# Altium project ADC1X2200-10_V1-1.PrjPCB (part 2 of 2)

## Sheet ADC-POWER SUPPLY 2.SchDoc: <SPECIFIC SHEET FUNCTION>
size A3; Date: DO NOT USE, RATHER USE PROJ OPTIONS; DrawnBy: DO NOT USE, RATHER USE PROJ OPTIONS; Engineer: DO NOT USE, RATHER USE PROJ OPTIONS; Organization: DO NOT USE, RATHER USE PROJ OPTIONS; DocumentNumber: 12; Revision: DO NOT USE, RATHER USE PROJ OPTIONS; SheetNumber: 12; SheetTotal: 12; SCH_Sheet_Filename: ADC-POWER SUPPLY 2.SchDoc; CurrentTime: DO NOT USE, RATHER USE PROJ OPTIONS; Time: DO NOT USE, RATHER USE PROJ OPTIONS; DocumentFullPathAndName: DO NOT USE, RATHER USE PROJ OPTIONS; DocumentName: DO NOT USE, RATHER USE PROJ OPTIONS; ModifiedDate: DO NOT USE, RATHER USE PROJ OPTIONS; ImagePath: DO NOT USE, RATHER USE PROJ OPTIONS
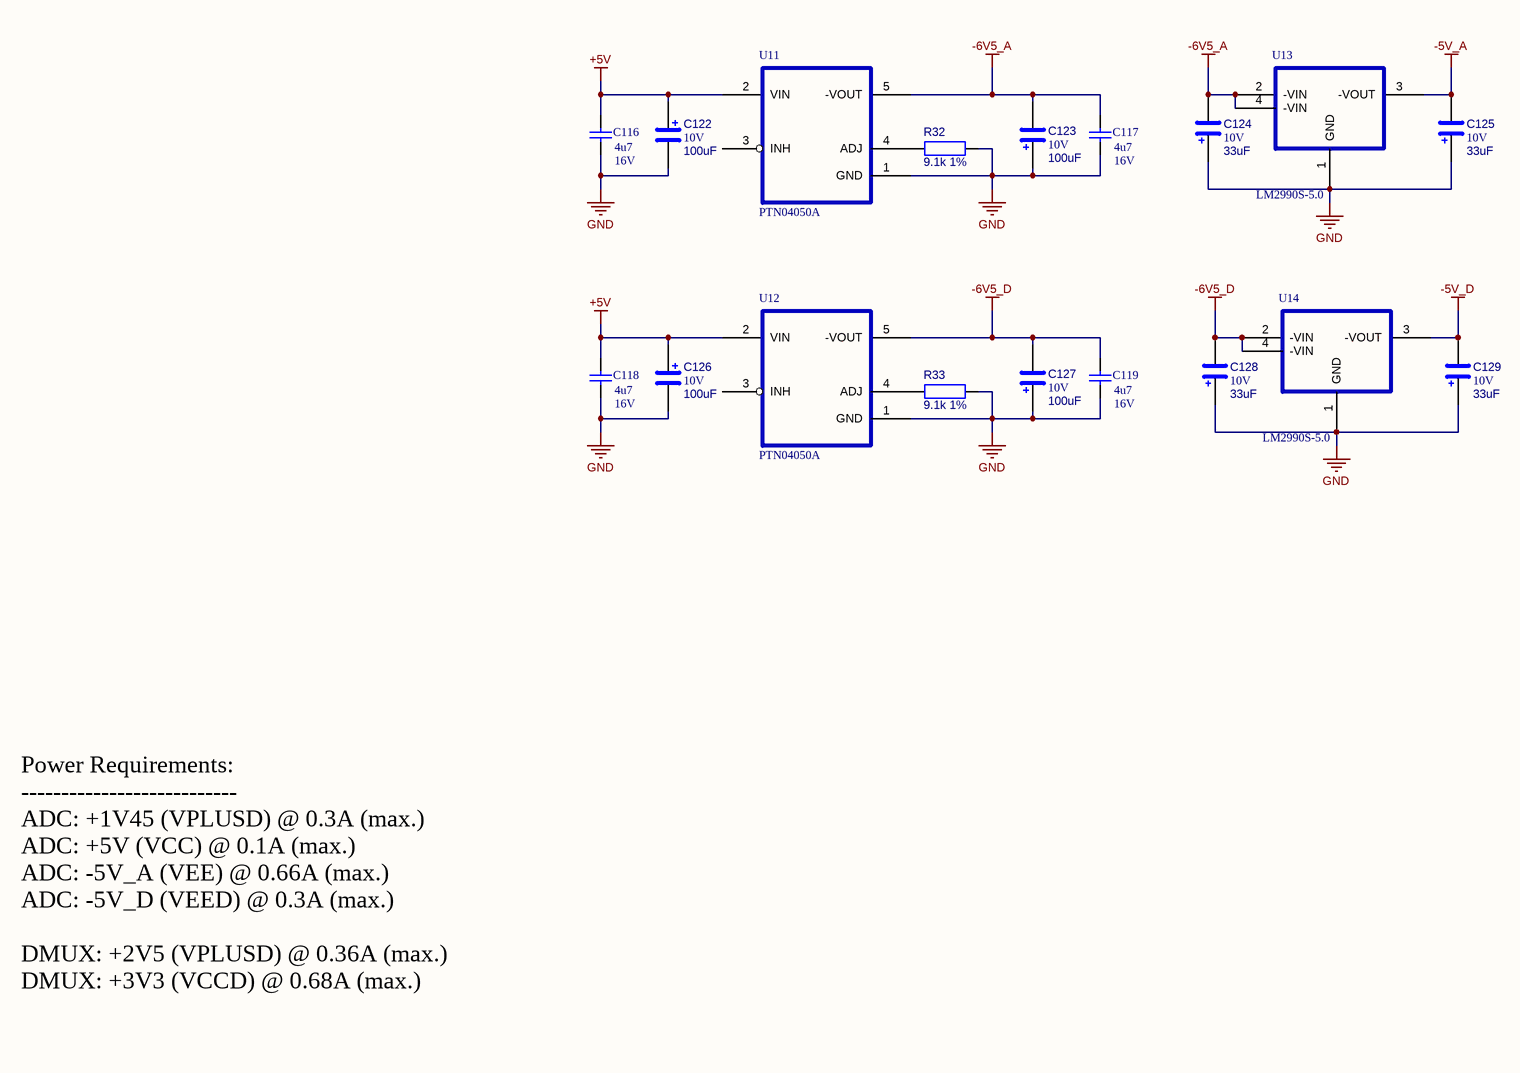
[diagram p7: ADC-POWER SUPPLY 2.SchDoc]

### Parts
C116  value 4u7  Voltage: 16V  [CAPC3225X220N]  (hidden comment: Capacitor 1210 SMD)
C117  value 4u7  Voltage: 16V  [CAPC3225X220N]  (hidden comment: Capacitor 1210 SMD)
C118  value 4u7  Voltage: 16V  [CAPC3225X220N]  (hidden comment: Capacitor 1210 SMD)
C119  value 4u7  Voltage: 16V  [CAPC3225X220N]  (hidden comment: Capacitor 1210 SMD)
C122  Voltage: 10V  [3528]  (hidden comment: 100uF)
C123  Voltage: 10V  [3528]  (hidden comment: 100uF)
C124  Voltage: 10V  [3528]  (hidden comment: 33uF)
C125  Voltage: 10V  [3528]  (hidden comment: 33uF)
C126  Voltage: 10V  [3528]  (hidden comment: 100uF)
C127  Voltage: 10V  [3528]  (hidden comment: 100uF)
C128  Voltage: 10V  [3528]  (hidden comment: 33uF)
C129  Voltage: 10V  [3528]  (hidden comment: 33uF)
R32  9.1k 1%  [0603]
R33  9.1k 1%  [0603]
U11  PTN04050A  [TI_EUU]
U12  PTN04050A  [TI_EUU]
U13  LM2990S-5.0  [TI_TO-263-3]
U14  LM2990S-5.0  [TI_TO-263-3]

### Nets
+5V: C116.2 C118.2 C122.1 C126.1 U11.2(VIN) U12.2(VIN)
-5V_A: C125.2 U13.3(-VOUT)
-5V_D: C129.2 U14.3(-VOUT)
-6V5_A: C117.2 C123.2 C124.2 U11.5(-VOUT) U13.2(-VIN) U13.4(-VIN)
-6V5_D: C119.2 C127.2 C128.2 U12.5(-VOUT) U14.2(-VIN) U14.4(-VIN)
GND: C116.1 C117.1 C118.1 C119.1 C122.2 C123.1 C124.1 C125.1 C126.2 C127.1 C128.1 C129.1 R32.2 R33.2 U11.1(GND) U12.1(GND) U13.1(GND) U14.1(GND)
NetR32_1: R32.1 U11.4(ADJ)
NetR33_1: R33.1 U12.4(ADJ)

Not connected (* = marked no-connect by the designer): U11 3(INH); U12 3(INH)

### Notes on the sheet
- Power Requirements:
  ---------------------------
  ADC: +1V45 (VPLUSD) @ 0.3A (max.)
  ADC: +5V (VCC) @ 0.1A (max.)
  ADC: -5V_A (VEE) @ 0.66A (max.)
  ADC: -5V_D (VEED) @ 0.3A (max.)
  DMUX: +2V5 (VPLUSD) @ 0.36A (max.)
  DMUX: +3V3 (VCCD) @ 0.68A (max.)
- 2009   THIS DOCUMENT IS THE PROPERTY OF THE OWNER, AND MAY NOT BE COPIED OR USED FOR ANY PURPOSE OTHER THAN THAT FOR WHICH IT IS SUPPLIED WITHOUT PERMISSION IN WRITING FROM THE OWNER.
- C
- DATESTAMP OF THIS PRINT
- DRAWN BY:
- DOCUMENT NUMBER:
- SCHEMATIC FILENAME:
- PCB FILENAME:
- ENGINEER:
- APPROVED:
- CIRCUIT DIAGRAM
- DATE
- SHEET
- REVISION
- OF

### Library data of the parts
C116-C119 = cap1210: Created_By: EDA-ASA; Checked_By: *; Checked_Date: *; HelpURL: *; Supplier1: *; Supplier2: *; Unit_Cost: *; MOQ: *; Leadtime: *; Inventory_Stock: *; Tolerance: *; Wattage: *; Package: 1210; ComponentLinked1Description: *; ComponentLinked1URL: *; ComponentLinked2Description: *; ComponentLinked2URL: *; ComponentLinked3Description: *; ComponentLinked3URL: *; ComponentLinked4Description: *; ComponentLinked4URL: *
C122-C129 = CAPACITOR-POLARISED: Created_By: EDA-ASA; Checked_By: *; Checked_Date: *; HelpURL: *; ComponentLinked1Description: *; ComponentLinked1URL: *; ComponentLinked2Description: *; ComponentLinked2URL: *; ComponentLinked3Description: *; ComponentLinked3URL: *; ComponentLinked4Description: *; ComponentLinked4URL: *; Supplier1: *; Supplier2: *; Unit_Cost: *; MOQ: *; Leadtime: *; Inventory_Stock: *; Tolerance: *; Wattage: *
  C122 C123 C126 C127: Value: 100uF
  C124 C125 C128 C129: Value: 33uF
R32 R33 = RES-0805: RESISTOR SMD 0603; Checked_By: NN; Manufacturer: *; Manufacturer_PN: *; Created_By: *; Checked_Date: 5-08-2009; HelpURL: *; ComponentLink1Description: Footprint Detail; ComponentLink1URL: *; ComponentLink2Description: Application Note; ComponentLink2URL: *; ComponentLink3Description: Layout Guidelines; ComponentLink3URL: *; ComponentLink4Description: Technology Reference; ComponentLink4URL: *; Supplier1: *; Supplier2: *; Unit_Cost: *; MOQ: *; Leadtime: *; Inventory_Stock: *; Tolerance: *; Wattage: *; Voltage: *; Package: 0603; ComponentLink5Description: Production Detail; ComponentLink5URL: *; Note: *; Stock Code: *; Value: 9.1k 1%

## Sheet ADC-SYNC INPUT.SchDoc: <SPECIFIC SHEET FUNCTION>
size A3; Date: DO NOT USE, RATHER USE PROJ OPTIONS; DrawnBy: DO NOT USE, RATHER USE PROJ OPTIONS; Engineer: DO NOT USE, RATHER USE PROJ OPTIONS; Organization: DO NOT USE, RATHER USE PROJ OPTIONS; DocumentNumber: 9; Revision: DO NOT USE, RATHER USE PROJ OPTIONS; SheetNumber: 7; SheetTotal: 12; SCH_Sheet_Filename: ADC-SYNC INPUT.SchDoc; CurrentTime: DO NOT USE, RATHER USE PROJ OPTIONS; Time: DO NOT USE, RATHER USE PROJ OPTIONS; DocumentFullPathAndName: DO NOT USE, RATHER USE PROJ OPTIONS; DocumentName: DO NOT USE, RATHER USE PROJ OPTIONS; ModifiedDate: DO NOT USE, RATHER USE PROJ OPTIONS; ImagePath: DO NOT USE, RATHER USE PROJ OPTIONS
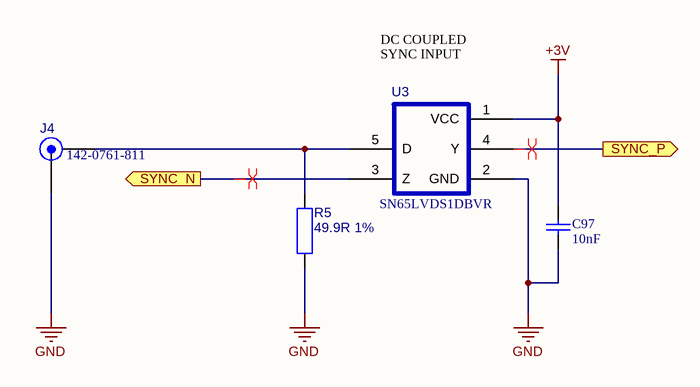
[diagram p8: ADC-SYNC INPUT.SchDoc]

### Parts
C97  value 10nF  [CAPC1005X55N]  (hidden comment: Capacitor 0402 SMD)
J4  142-0761-811  [EDGE_LAUNCH_TH_SMA]
R5  49.9R 1%  [0603]
U3  SN65LVDS1DBVR  [SOT95P280X145-5N]

### Ports
SYNC_N (out), SYNC_P (out)

### Nets
+3V: C97.2 U3.1(VCC)
GND: C97.1 J4.2 R5.2 U3.2(GND)
SYNC_N: U3.3(Z) ; port SYNC_N
SYNC_P: U3.4(Y) ; port SYNC_P
NetJ4_1: J4.1 R5.1 U3.5(D)

### Layout directives
differential pair: SYNC_N, SYNC_P

### Notes on the sheet
- DC COUPLED SYNC INPUT
- 2009   THIS DOCUMENT IS THE PROPERTY OF THE OWNER, AND MAY NOT BE COPIED OR USED FOR ANY PURPOSE OTHER THAN THAT FOR WHICH IT IS SUPPLIED WITHOUT PERMISSION IN WRITING FROM THE OWNER.
- C
- DATESTAMP OF THIS PRINT
- DRAWN BY:
- DOCUMENT NUMBER:
- SCHEMATIC FILENAME:
- PCB FILENAME:
- ENGINEER:
- APPROVED:
- CIRCUIT DIAGRAM
- DATE
- SHEET
- REVISION
- OF

### Library data of the parts
C97 = cap0402: Created_By: EDA-ASA; Checked_By: *; Checked_Date: *; HelpURL: *; Supplier1: *; Supplier2: *; Unit_Cost: *; MOQ: *; Leadtime: *; Inventory_Stock: *; Tolerance: *; Wattage: *; Package: 0402; ComponentLinked1Description: *; ComponentLinked1URL: *; ComponentLinked2Description: *; ComponentLinked2URL: *; ComponentLinked3Description: *; ComponentLinked3URL: *; ComponentLinked4Description: *; ComponentLinked4URL: *
J4 = 142-0761-811: High Frequency SMA End Lauch Connector; Manufacturer: JOHNSON; Created_By: CT; Checked_By: *; Checked_Date: *; HelpURL: *; ComponentLink1Description: High Frequency SMA End Lauch Connector; ComponentLink1URL: *; ComponentLink2Description: Application Note; ComponentLink2URL: *; ComponentLink3Description: Layout Guidelines; ComponentLink3URL: *; ComponentLink4Description: Technology Reference; ComponentLink4URL: *; Supplier1: *; Supplier2: *; Unit_Cost: *; MOQ: *; Leadtime: *; Inventory_Stock: *; Tolerance: *; Wattage: *; Package: *; ComponentLink5Description: Production Detail; ComponentLink5URL: *; Note: *; Stock Code: *; Voltage: *; Manufacturer_PN: 142-0761-811
R5 = RES-0805: RESISTOR SMD 0603; Checked_By: NN; Manufacturer: *; Manufacturer_PN: *; Created_By: *; Checked_Date: 5-08-2009; HelpURL: *; ComponentLink1Description: Footprint Detail; ComponentLink1URL: *; ComponentLink2Description: Application Note; ComponentLink2URL: *; ComponentLink3Description: Layout Guidelines; ComponentLink3URL: *; ComponentLink4Description: Technology Reference; ComponentLink4URL: *; Supplier1: *; Supplier2: *; Unit_Cost: *; MOQ: *; Leadtime: *; Inventory_Stock: *; Tolerance: *; Wattage: *; Voltage: *; Package: 0603; ComponentLink5Description: Production Detail; ComponentLink5URL: *; Note: *; Stock Code: *; Value: 49.9R 1%
U3 = SN65LVDS1DBVR: High Speed Differential Line Driver/Receiver; Manufacturer: TI; Created_By: IN; Manufacturer_PN: SN65LVDS1DBVR; Checked_By: *; Checked_Date: *; HelpURL: X:\Datasheets\By_Manufacturer\TI\sn65lvds1.pdf; ComponentLink1Description: X:\Datasheets\By_Manufacturer\TI\sn65lvds1.pdf#page=13; ComponentLink1URL: *; ComponentLink2Description: Application Note; ComponentLink2URL: *; ComponentLink3Description: Layout Guidelines; ComponentLink3URL: *; ComponentLink4Description: Technology Reference; ComponentLink4URL: *; Supplier1: *; Supplier2: *; Unit_Cost: *; MOQ: *; Leadtime: *; Inventory_Stock: *; Tolerance: *; Wattage: *; Voltage: *; Package: *; ComponentLink5Description: Production Detail; ComponentLink5URL: *; Note: *; Stock Code: *

## Sheet ADC-DMUX PSU.SchDoc: <SPECIFIC SHEET FUNCTION>
size A3; Date: DO NOT USE, RATHER USE PROJ OPTIONS; DrawnBy: DO NOT USE, RATHER USE PROJ OPTIONS; Engineer: DO NOT USE, RATHER USE PROJ OPTIONS; Organization: DO NOT USE, RATHER USE PROJ OPTIONS; DocumentNumber: 1; Revision: DO NOT USE, RATHER USE PROJ OPTIONS; SheetNumber: 10; SheetTotal: 12; SCH_Sheet_Filename: ADC-DMUX PSU.SchDoc; CurrentTime: DO NOT USE, RATHER USE PROJ OPTIONS; Time: DO NOT USE, RATHER USE PROJ OPTIONS; DocumentFullPathAndName: DO NOT USE, RATHER USE PROJ OPTIONS; DocumentName: DO NOT USE, RATHER USE PROJ OPTIONS; ModifiedDate: DO NOT USE, RATHER USE PROJ OPTIONS; ImagePath: DO NOT USE, RATHER USE PROJ OPTIONS
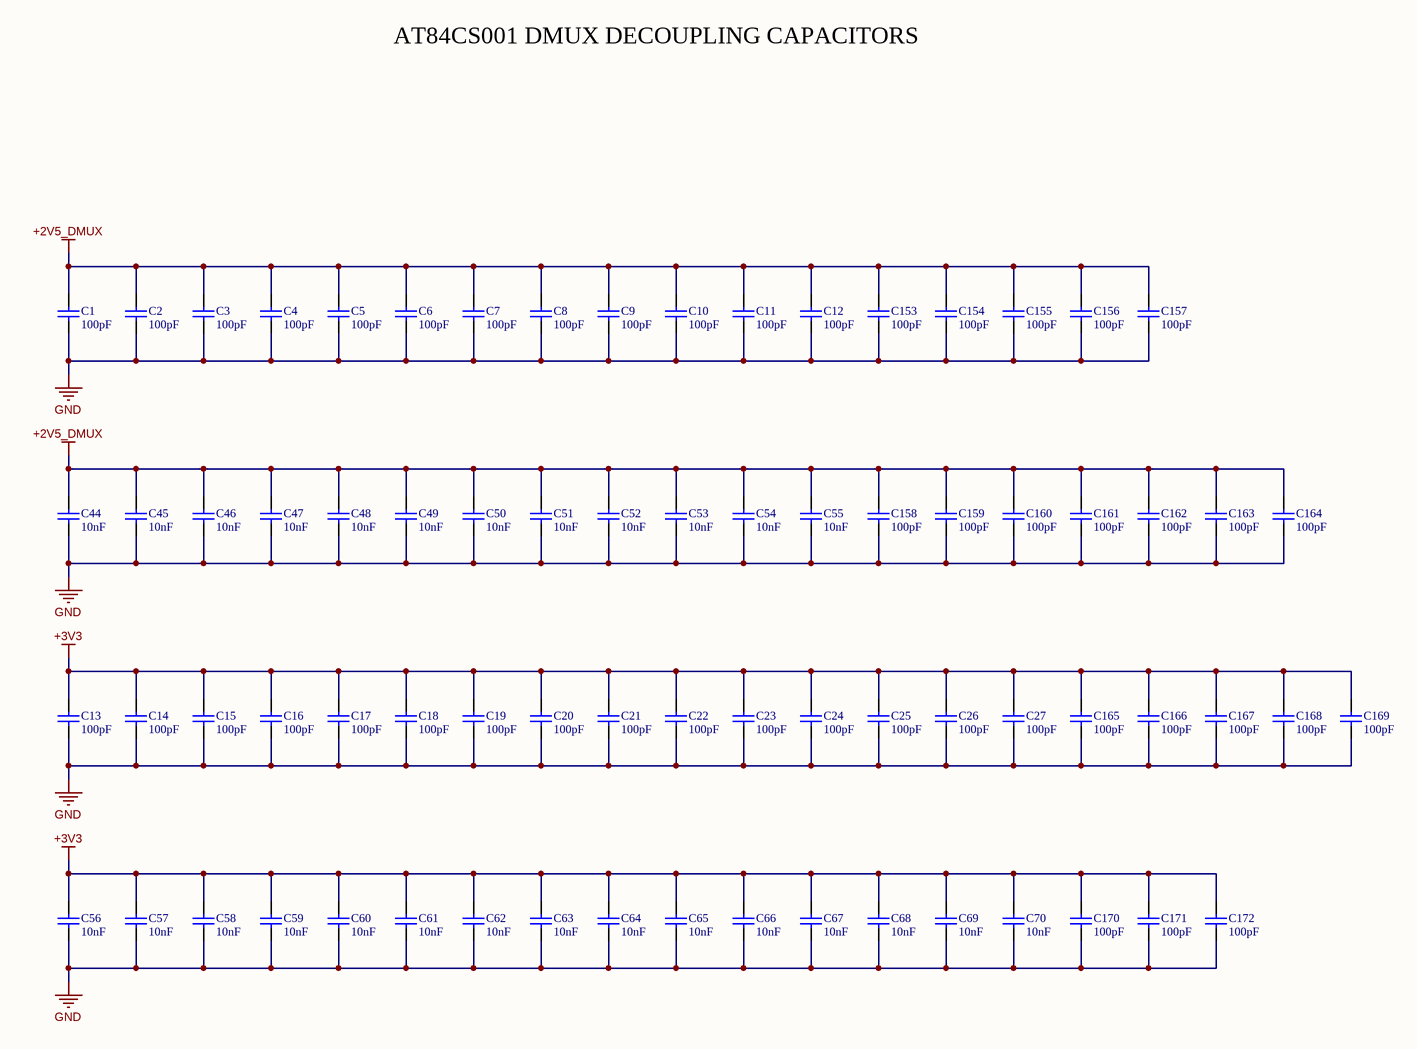
[diagram p9: ADC-DMUX PSU.SchDoc]

### Parts
C1  value 100pF  [CAPC1005X55N]  (hidden comment: Capacitor 0402 SMD)
C2  value 100pF  [CAPC1005X55N]  (hidden comment: Capacitor 0402 SMD)
C3  value 100pF  [CAPC1005X55N]  (hidden comment: Capacitor 0402 SMD)
C4  value 100pF  [CAPC1005X55N]  (hidden comment: Capacitor 0402 SMD)
C5  value 100pF  [CAPC1005X55N]  (hidden comment: Capacitor 0402 SMD)
C6  value 100pF  [CAPC1005X55N]  (hidden comment: Capacitor 0402 SMD)
C7  value 100pF  [CAPC1005X55N]  (hidden comment: Capacitor 0402 SMD)
C8  value 100pF  [CAPC1005X55N]  (hidden comment: Capacitor 0402 SMD)
C9  value 100pF  [CAPC1005X55N]  (hidden comment: Capacitor 0402 SMD)
C10  value 100pF  [CAPC1005X55N]  (hidden comment: Capacitor 0402 SMD)
C11  value 100pF  [CAPC1005X55N]  (hidden comment: Capacitor 0402 SMD)
C12  value 100pF  [CAPC1005X55N]  (hidden comment: Capacitor 0402 SMD)
C13  value 100pF  [CAPC1005X55N]  (hidden comment: Capacitor 0402 SMD)
C14  value 100pF  [CAPC1005X55N]  (hidden comment: Capacitor 0402 SMD)
C15  value 100pF  [CAPC1005X55N]  (hidden comment: Capacitor 0402 SMD)
C16  value 100pF  [CAPC1005X55N]  (hidden comment: Capacitor 0402 SMD)
C17  value 100pF  [CAPC1005X55N]  (hidden comment: Capacitor 0402 SMD)
C18  value 100pF  [CAPC1005X55N]  (hidden comment: Capacitor 0402 SMD)
C19  value 100pF  [CAPC1005X55N]  (hidden comment: Capacitor 0402 SMD)
C20  value 100pF  [CAPC1005X55N]  (hidden comment: Capacitor 0402 SMD)
C21  value 100pF  [CAPC1005X55N]  (hidden comment: Capacitor 0402 SMD)
C22  value 100pF  [CAPC1005X55N]  (hidden comment: Capacitor 0402 SMD)
C23  value 100pF  [CAPC1005X55N]  (hidden comment: Capacitor 0402 SMD)
C24  value 100pF  [CAPC1005X55N]  (hidden comment: Capacitor 0402 SMD)
C25  value 100pF  [CAPC1005X55N]  (hidden comment: Capacitor 0402 SMD)
C26  value 100pF  [CAPC1005X55N]  (hidden comment: Capacitor 0402 SMD)
C27  value 100pF  [CAPC1005X55N]  (hidden comment: Capacitor 0402 SMD)
C44  value 10nF  [CAPC1005X55N]  (hidden comment: Capacitor 0402 SMD)
C45  value 10nF  [CAPC1005X55N]  (hidden comment: Capacitor 0402 SMD)
C46  value 10nF  [CAPC1005X55N]  (hidden comment: Capacitor 0402 SMD)
C47  value 10nF  [CAPC1005X55N]  (hidden comment: Capacitor 0402 SMD)
C48  value 10nF  [CAPC1005X55N]  (hidden comment: Capacitor 0402 SMD)
C49  value 10nF  [CAPC1005X55N]  (hidden comment: Capacitor 0402 SMD)
C50  value 10nF  [CAPC1005X55N]  (hidden comment: Capacitor 0402 SMD)
C51  value 10nF  [CAPC1005X55N]  (hidden comment: Capacitor 0402 SMD)
C52  value 10nF  [CAPC1005X55N]  (hidden comment: Capacitor 0402 SMD)
C53  value 10nF  [CAPC1005X55N]  (hidden comment: Capacitor 0402 SMD)
C54  value 10nF  [CAPC1005X55N]  (hidden comment: Capacitor 0402 SMD)
C55  value 10nF  [CAPC1005X55N]  (hidden comment: Capacitor 0402 SMD)
C56  value 10nF  [CAPC1005X55N]  (hidden comment: Capacitor 0402 SMD)
C57  value 10nF  [CAPC1005X55N]  (hidden comment: Capacitor 0402 SMD)
C58  value 10nF  [CAPC1005X55N]  (hidden comment: Capacitor 0402 SMD)
C59  value 10nF  [CAPC1005X55N]  (hidden comment: Capacitor 0402 SMD)
C60  value 10nF  [CAPC1005X55N]  (hidden comment: Capacitor 0402 SMD)
C61  value 10nF  [CAPC1005X55N]  (hidden comment: Capacitor 0402 SMD)
C62  value 10nF  [CAPC1005X55N]  (hidden comment: Capacitor 0402 SMD)
C63  value 10nF  [CAPC1005X55N]  (hidden comment: Capacitor 0402 SMD)
C64  value 10nF  [CAPC1005X55N]  (hidden comment: Capacitor 0402 SMD)
C65  value 10nF  [CAPC1005X55N]  (hidden comment: Capacitor 0402 SMD)
C66  value 10nF  [CAPC1005X55N]  (hidden comment: Capacitor 0402 SMD)
C67  value 10nF  [CAPC1005X55N]  (hidden comment: Capacitor 0402 SMD)
C68  value 10nF  [CAPC1005X55N]  (hidden comment: Capacitor 0402 SMD)
C69  value 10nF  [CAPC1005X55N]  (hidden comment: Capacitor 0402 SMD)
C70  value 10nF  [CAPC1005X55N]  (hidden comment: Capacitor 0402 SMD)
C153  value 100pF  [CAPC1005X55N]  (hidden comment: Capacitor 0402 SMD)
C154  value 100pF  [CAPC1005X55N]  (hidden comment: Capacitor 0402 SMD)
C155  value 100pF  [CAPC1005X55N]  (hidden comment: Capacitor 0402 SMD)
C156  value 100pF  [CAPC1005X55N]  (hidden comment: Capacitor 0402 SMD)
C157  value 100pF  [CAPC1005X55N]  (hidden comment: Capacitor 0402 SMD)
C158  value 100pF  [CAPC1005X55N]  (hidden comment: Capacitor 0402 SMD)
C159  value 100pF  [CAPC1005X55N]  (hidden comment: Capacitor 0402 SMD)
C160  value 100pF  [CAPC1005X55N]  (hidden comment: Capacitor 0402 SMD)
C161  value 100pF  [CAPC1005X55N]  (hidden comment: Capacitor 0402 SMD)
C162  value 100pF  [CAPC1005X55N]  (hidden comment: Capacitor 0402 SMD)
C163  value 100pF  [CAPC1005X55N]  (hidden comment: Capacitor 0402 SMD)
C164  value 100pF  [CAPC1005X55N]  (hidden comment: Capacitor 0402 SMD)
C165  value 100pF  [CAPC1005X55N]  (hidden comment: Capacitor 0402 SMD)
C166  value 100pF  [CAPC1005X55N]  (hidden comment: Capacitor 0402 SMD)
C167  value 100pF  [CAPC1005X55N]  (hidden comment: Capacitor 0402 SMD)
C168  value 100pF  [CAPC1005X55N]  (hidden comment: Capacitor 0402 SMD)
C169  value 100pF  [CAPC1005X55N]  (hidden comment: Capacitor 0402 SMD)
C170  value 100pF  [CAPC1005X55N]  (hidden comment: Capacitor 0402 SMD)
C171  value 100pF  [CAPC1005X55N]  (hidden comment: Capacitor 0402 SMD)
C172  value 100pF  [CAPC1005X55N]  (hidden comment: Capacitor 0402 SMD)

### Nets
+2V5_DMUX: C1.1 C2.1 C3.1 C4.1 C5.1 C6.1 C7.1 C8.1 C9.1 C10.1 C11.1 C12.1 C44.1 C45.1 C46.1 C47.1 C48.1 C49.1 C50.1 C51.1 C52.1 C53.1 C54.1 C55.1 C153.1 C154.1 C155.1 C156.1 C157.1 C158.1 C159.1 C160.1 C161.1 C162.1 C163.1 C164.1
+3V3: C13.1 C14.1 C15.1 C16.1 C17.1 C18.1 C19.1 C20.1 C21.1 C22.1 C23.1 C24.1 C25.1 C26.1 C27.1 C56.1 C57.1 C58.1 C59.1 C60.1 C61.1 C62.1 C63.1 C64.1 C65.1 C66.1 C67.1 C68.1 C69.1 C70.1 C165.1 C166.1 C167.1 C168.1 C169.1 C170.1 C171.1 C172.1
GND: C1.2 C2.2 C3.2 C4.2 C5.2 C6.2 C7.2 C8.2 C9.2 C10.2 C11.2 C12.2 C13.2 C14.2 C15.2 C16.2 C17.2 C18.2 C19.2 C20.2 C21.2 C22.2 C23.2 C24.2 C25.2 C26.2 C27.2 C44.2 C45.2 C46.2 C47.2 C48.2 C49.2 C50.2 C51.2 C52.2 C53.2 C54.2 C55.2 C56.2 C57.2 C58.2 C59.2 C60.2 C61.2 C62.2 C63.2 C64.2 C65.2 C66.2 C67.2 C68.2 C69.2 C70.2 C153.2 C154.2 C155.2 C156.2 C157.2 C158.2 C159.2 C160.2 C161.2 C162.2 C163.2 C164.2 C165.2 C166.2 C167.2 C168.2 C169.2 C170.2 C171.2 C172.2

### Notes on the sheet
- AT84CS001 DMUX DECOUPLING CAPACITORS
- 2009   THIS DOCUMENT IS THE PROPERTY OF THE OWNER, AND MAY NOT BE COPIED OR USED FOR ANY PURPOSE OTHER THAN THAT FOR WHICH IT IS SUPPLIED WITHOUT PERMISSION IN WRITING FROM THE OWNER.
- C
- DATESTAMP OF THIS PRINT
- DRAWN BY:
- DOCUMENT NUMBER:
- SCHEMATIC FILENAME:
- PCB FILENAME:
- ENGINEER:
- APPROVED:
- CIRCUIT DIAGRAM
- DATE
- SHEET
- REVISION
- OF

### Library data of the parts
C1-C27 C44-C70 C153-C172 = cap0402: Created_By: EDA-ASA; Checked_By: *; Checked_Date: *; HelpURL: *; Supplier1: *; Supplier2: *; Unit_Cost: *; MOQ: *; Leadtime: *; Inventory_Stock: *; Tolerance: *; Wattage: *; Package: 0402; ComponentLinked1Description: *; ComponentLinked1URL: *; ComponentLinked2Description: *; ComponentLinked2URL: *; ComponentLinked3Description: *; ComponentLinked3URL: *; ComponentLinked4Description: *; ComponentLinked4URL: *

## Sheet ADC-ADC PSU.SchDoc: <SPECIFIC SHEET FUNCTION>
size A3; Date: DO NOT USE, RATHER USE PROJ OPTIONS; DrawnBy: DO NOT USE, RATHER USE PROJ OPTIONS; Engineer: DO NOT USE, RATHER USE PROJ OPTIONS; Organization: DO NOT USE, RATHER USE PROJ OPTIONS; DocumentNumber: 1; Revision: DO NOT USE, RATHER USE PROJ OPTIONS; SheetNumber: 9; SheetTotal: 12; SCH_Sheet_Filename: ADC-ADC PSU.SchDoc; CurrentTime: DO NOT USE, RATHER USE PROJ OPTIONS; Time: DO NOT USE, RATHER USE PROJ OPTIONS; DocumentFullPathAndName: DO NOT USE, RATHER USE PROJ OPTIONS; DocumentName: DO NOT USE, RATHER USE PROJ OPTIONS; ModifiedDate: DO NOT USE, RATHER USE PROJ OPTIONS; ImagePath: DO NOT USE, RATHER USE PROJ OPTIONS
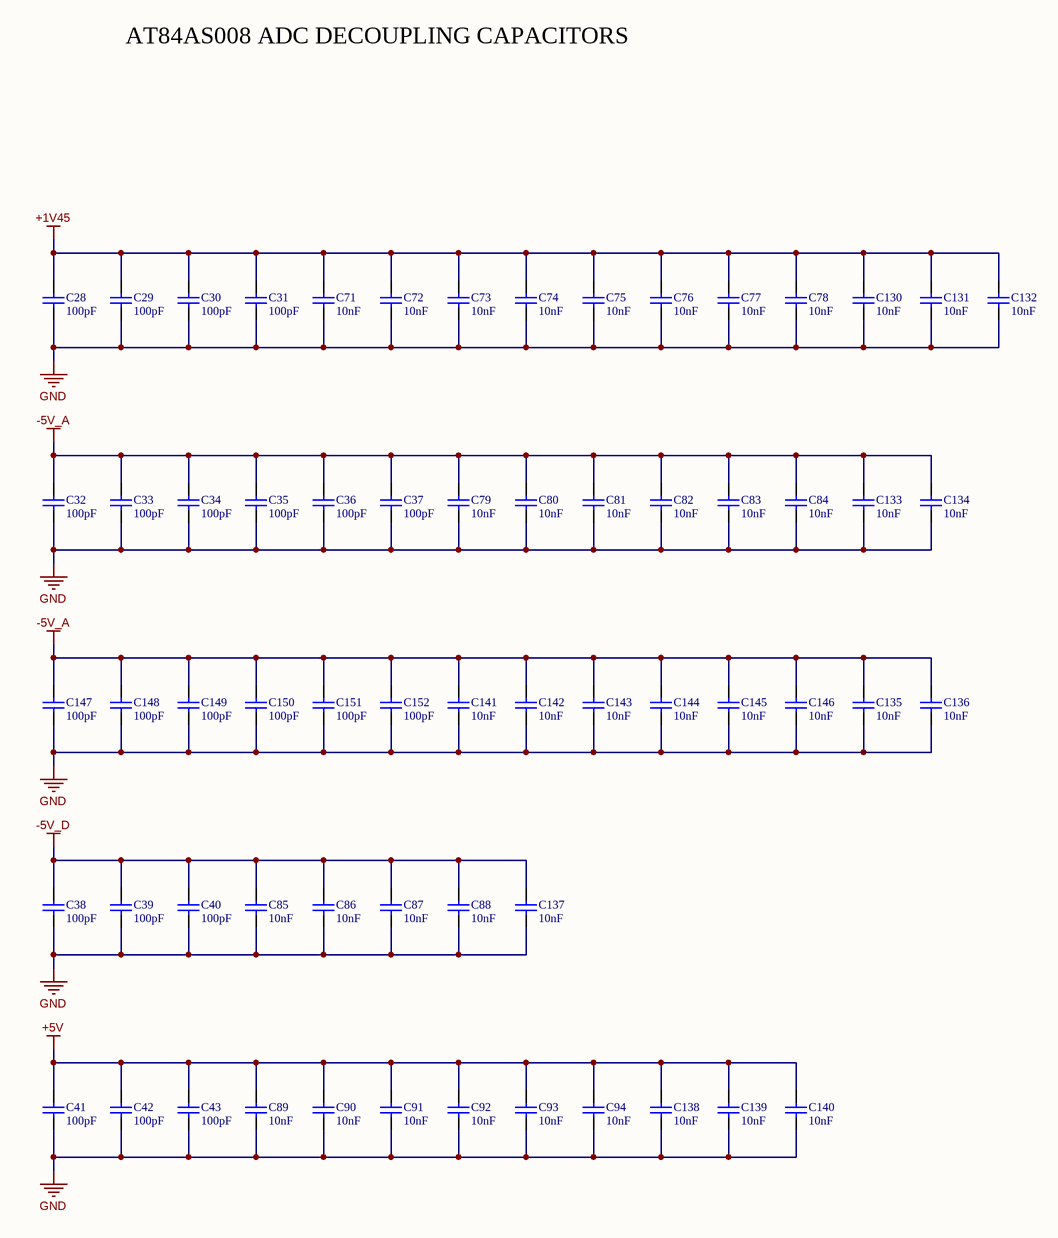
[diagram p10: ADC-ADC PSU.SchDoc]

### Parts
C28  value 100pF  [CAPC1005X55N]  (hidden comment: Capacitor 0402 SMD)
C29  value 100pF  [CAPC1005X55N]  (hidden comment: Capacitor 0402 SMD)
C30  value 100pF  [CAPC1005X55N]  (hidden comment: Capacitor 0402 SMD)
C31  value 100pF  [CAPC1005X55N]  (hidden comment: Capacitor 0402 SMD)
C32  value 100pF  [CAPC1005X55N]  (hidden comment: Capacitor 0402 SMD)
C33  value 100pF  [CAPC1005X55N]  (hidden comment: Capacitor 0402 SMD)
C34  value 100pF  [CAPC1005X55N]  (hidden comment: Capacitor 0402 SMD)
C35  value 100pF  [CAPC1005X55N]  (hidden comment: Capacitor 0402 SMD)
C36  value 100pF  [CAPC1005X55N]  (hidden comment: Capacitor 0402 SMD)
C37  value 100pF  [CAPC1005X55N]  (hidden comment: Capacitor 0402 SMD)
C38  value 100pF  [CAPC1005X55N]  (hidden comment: Capacitor 0402 SMD)
C39  value 100pF  [CAPC1005X55N]  (hidden comment: Capacitor 0402 SMD)
C40  value 100pF  [CAPC1005X55N]  (hidden comment: Capacitor 0402 SMD)
C41  value 100pF  [CAPC1005X55N]  (hidden comment: Capacitor 0402 SMD)
C42  value 100pF  [CAPC1005X55N]  (hidden comment: Capacitor 0402 SMD)
C43  value 100pF  [CAPC1005X55N]  (hidden comment: Capacitor 0402 SMD)
C71  value 10nF  [CAPC1005X55N]  (hidden comment: Capacitor 0402 SMD)
C72  value 10nF  [CAPC1005X55N]  (hidden comment: Capacitor 0402 SMD)
C73  value 10nF  [CAPC1005X55N]  (hidden comment: Capacitor 0402 SMD)
C74  value 10nF  [CAPC1005X55N]  (hidden comment: Capacitor 0402 SMD)
C75  value 10nF  [CAPC1005X55N]  (hidden comment: Capacitor 0402 SMD)
C76  value 10nF  [CAPC1005X55N]  (hidden comment: Capacitor 0402 SMD)
C77  value 10nF  [CAPC1005X55N]  (hidden comment: Capacitor 0402 SMD)
C78  value 10nF  [CAPC1005X55N]  (hidden comment: Capacitor 0402 SMD)
C79  value 10nF  [CAPC1005X55N]  (hidden comment: Capacitor 0402 SMD)
C80  value 10nF  [CAPC1005X55N]  (hidden comment: Capacitor 0402 SMD)
C81  value 10nF  [CAPC1005X55N]  (hidden comment: Capacitor 0402 SMD)
C82  value 10nF  [CAPC1005X55N]  (hidden comment: Capacitor 0402 SMD)
C83  value 10nF  [CAPC1005X55N]  (hidden comment: Capacitor 0402 SMD)
C84  value 10nF  [CAPC1005X55N]  (hidden comment: Capacitor 0402 SMD)
C85  value 10nF  [CAPC1005X55N]  (hidden comment: Capacitor 0402 SMD)
C86  value 10nF  [CAPC1005X55N]  (hidden comment: Capacitor 0402 SMD)
C87  value 10nF  [CAPC1005X55N]  (hidden comment: Capacitor 0402 SMD)
C88  value 10nF  [CAPC1005X55N]  (hidden comment: Capacitor 0402 SMD)
C89  value 10nF  [CAPC1005X55N]  (hidden comment: Capacitor 0402 SMD)
C90  value 10nF  [CAPC1005X55N]  (hidden comment: Capacitor 0402 SMD)
C91  value 10nF  [CAPC1005X55N]  (hidden comment: Capacitor 0402 SMD)
C92  value 10nF  [CAPC1005X55N]  (hidden comment: Capacitor 0402 SMD)
C93  value 10nF  [CAPC1005X55N]  (hidden comment: Capacitor 0402 SMD)
C94  value 10nF  [CAPC1005X55N]  (hidden comment: Capacitor 0402 SMD)
C130  value 10nF  [CAPC1005X55N]  (hidden comment: Capacitor 0402 SMD)
C131  value 10nF  [CAPC1005X55N]  (hidden comment: Capacitor 0402 SMD)
C132  value 10nF  [CAPC1005X55N]  (hidden comment: Capacitor 0402 SMD)
C133  value 10nF  [CAPC1005X55N]  (hidden comment: Capacitor 0402 SMD)
C134  value 10nF  [CAPC1005X55N]  (hidden comment: Capacitor 0402 SMD)
C135  value 10nF  [CAPC1005X55N]  (hidden comment: Capacitor 0402 SMD)
C136  value 10nF  [CAPC1005X55N]  (hidden comment: Capacitor 0402 SMD)
C137  value 10nF  [CAPC1005X55N]  (hidden comment: Capacitor 0402 SMD)
C138  value 10nF  [CAPC1005X55N]  (hidden comment: Capacitor 0402 SMD)
C139  value 10nF  [CAPC1005X55N]  (hidden comment: Capacitor 0402 SMD)
C140  value 10nF  [CAPC1005X55N]  (hidden comment: Capacitor 0402 SMD)
C141  value 10nF  [CAPC1005X55N]  (hidden comment: Capacitor 0402 SMD)
C142  value 10nF  [CAPC1005X55N]  (hidden comment: Capacitor 0402 SMD)
C143  value 10nF  [CAPC1005X55N]  (hidden comment: Capacitor 0402 SMD)
C144  value 10nF  [CAPC1005X55N]  (hidden comment: Capacitor 0402 SMD)
C145  value 10nF  [CAPC1005X55N]  (hidden comment: Capacitor 0402 SMD)
C146  value 10nF  [CAPC1005X55N]  (hidden comment: Capacitor 0402 SMD)
C147  value 100pF  [CAPC1005X55N]  (hidden comment: Capacitor 0402 SMD)
C148  value 100pF  [CAPC1005X55N]  (hidden comment: Capacitor 0402 SMD)
C149  value 100pF  [CAPC1005X55N]  (hidden comment: Capacitor 0402 SMD)
C150  value 100pF  [CAPC1005X55N]  (hidden comment: Capacitor 0402 SMD)
C151  value 100pF  [CAPC1005X55N]  (hidden comment: Capacitor 0402 SMD)
C152  value 100pF  [CAPC1005X55N]  (hidden comment: Capacitor 0402 SMD)

### Nets
+1V45: C28.1 C29.1 C30.1 C31.1 C71.1 C72.1 C73.1 C74.1 C75.1 C76.1 C77.1 C78.1 C130.1 C131.1 C132.1
+5V: C41.1 C42.1 C43.1 C89.1 C90.1 C91.1 C92.1 C93.1 C94.1 C138.1 C139.1 C140.1
-5V_A: C32.1 C33.1 C34.1 C35.1 C36.1 C37.1 C79.1 C80.1 C81.1 C82.1 C83.1 C84.1 C133.1 C134.1 C135.1 C136.1 C141.1 C142.1 C143.1 C144.1 C145.1 C146.1 C147.1 C148.1 C149.1 C150.1 C151.1 C152.1
-5V_D: C38.1 C39.1 C40.1 C85.1 C86.1 C87.1 C88.1 C137.1
GND: C28.2 C29.2 C30.2 C31.2 C32.2 C33.2 C34.2 C35.2 C36.2 C37.2 C38.2 C39.2 C40.2 C41.2 C42.2 C43.2 C71.2 C72.2 C73.2 C74.2 C75.2 C76.2 C77.2 C78.2 C79.2 C80.2 C81.2 C82.2 C83.2 C84.2 C85.2 C86.2 C87.2 C88.2 C89.2 C90.2 C91.2 C92.2 C93.2 C94.2 C130.2 C131.2 C132.2 C133.2 C134.2 C135.2 C136.2 C137.2 C138.2 C139.2 C140.2 C141.2 C142.2 C143.2 C144.2 C145.2 C146.2 C147.2 C148.2 C149.2 C150.2 C151.2 C152.2

### Notes on the sheet
- AT84AS008 ADC DECOUPLING CAPACITORS
- 2009   THIS DOCUMENT IS THE PROPERTY OF THE OWNER, AND MAY NOT BE COPIED OR USED FOR ANY PURPOSE OTHER THAN THAT FOR WHICH IT IS SUPPLIED WITHOUT PERMISSION IN WRITING FROM THE OWNER.
- C
- DATESTAMP OF THIS PRINT
- DRAWN BY:
- DOCUMENT NUMBER:
- SCHEMATIC FILENAME:
- PCB FILENAME:
- ENGINEER:
- APPROVED:
- CIRCUIT DIAGRAM
- DATE
- SHEET
- REVISION
- OF

### Library data of the parts
C28-C43 C71-C94 C130-C152 = cap0402: Created_By: EDA-ASA; Checked_By: *; Checked_Date: *; HelpURL: *; Supplier1: *; Supplier2: *; Unit_Cost: *; MOQ: *; Leadtime: *; Inventory_Stock: *; Tolerance: *; Wattage: *; Package: 0402; ComponentLinked1Description: *; ComponentLinked1URL: *; ComponentLinked2Description: *; ComponentLinked2URL: *; ComponentLinked3Description: *; ComponentLinked3URL: *; ComponentLinked4Description: *; ComponentLinked4URL: *

## Sheet ADC-POWER SUPPLY.SchDoc: <SPECIFIC SHEET FUNCTION>
size A3; Date: DO NOT USE, RATHER USE PROJ OPTIONS; DrawnBy: DO NOT USE, RATHER USE PROJ OPTIONS; Engineer: DO NOT USE, RATHER USE PROJ OPTIONS; Organization: DO NOT USE, RATHER USE PROJ OPTIONS; DocumentNumber: 12; Revision: DO NOT USE, RATHER USE PROJ OPTIONS; SheetNumber: 11; SheetTotal: 12; SCH_Sheet_Filename: ADC-POWER SUPPLY.SchDoc; CurrentTime: DO NOT USE, RATHER USE PROJ OPTIONS; Time: DO NOT USE, RATHER USE PROJ OPTIONS; DocumentFullPathAndName: DO NOT USE, RATHER USE PROJ OPTIONS; DocumentName: DO NOT USE, RATHER USE PROJ OPTIONS; ModifiedDate: DO NOT USE, RATHER USE PROJ OPTIONS; ImagePath: DO NOT USE, RATHER USE PROJ OPTIONS
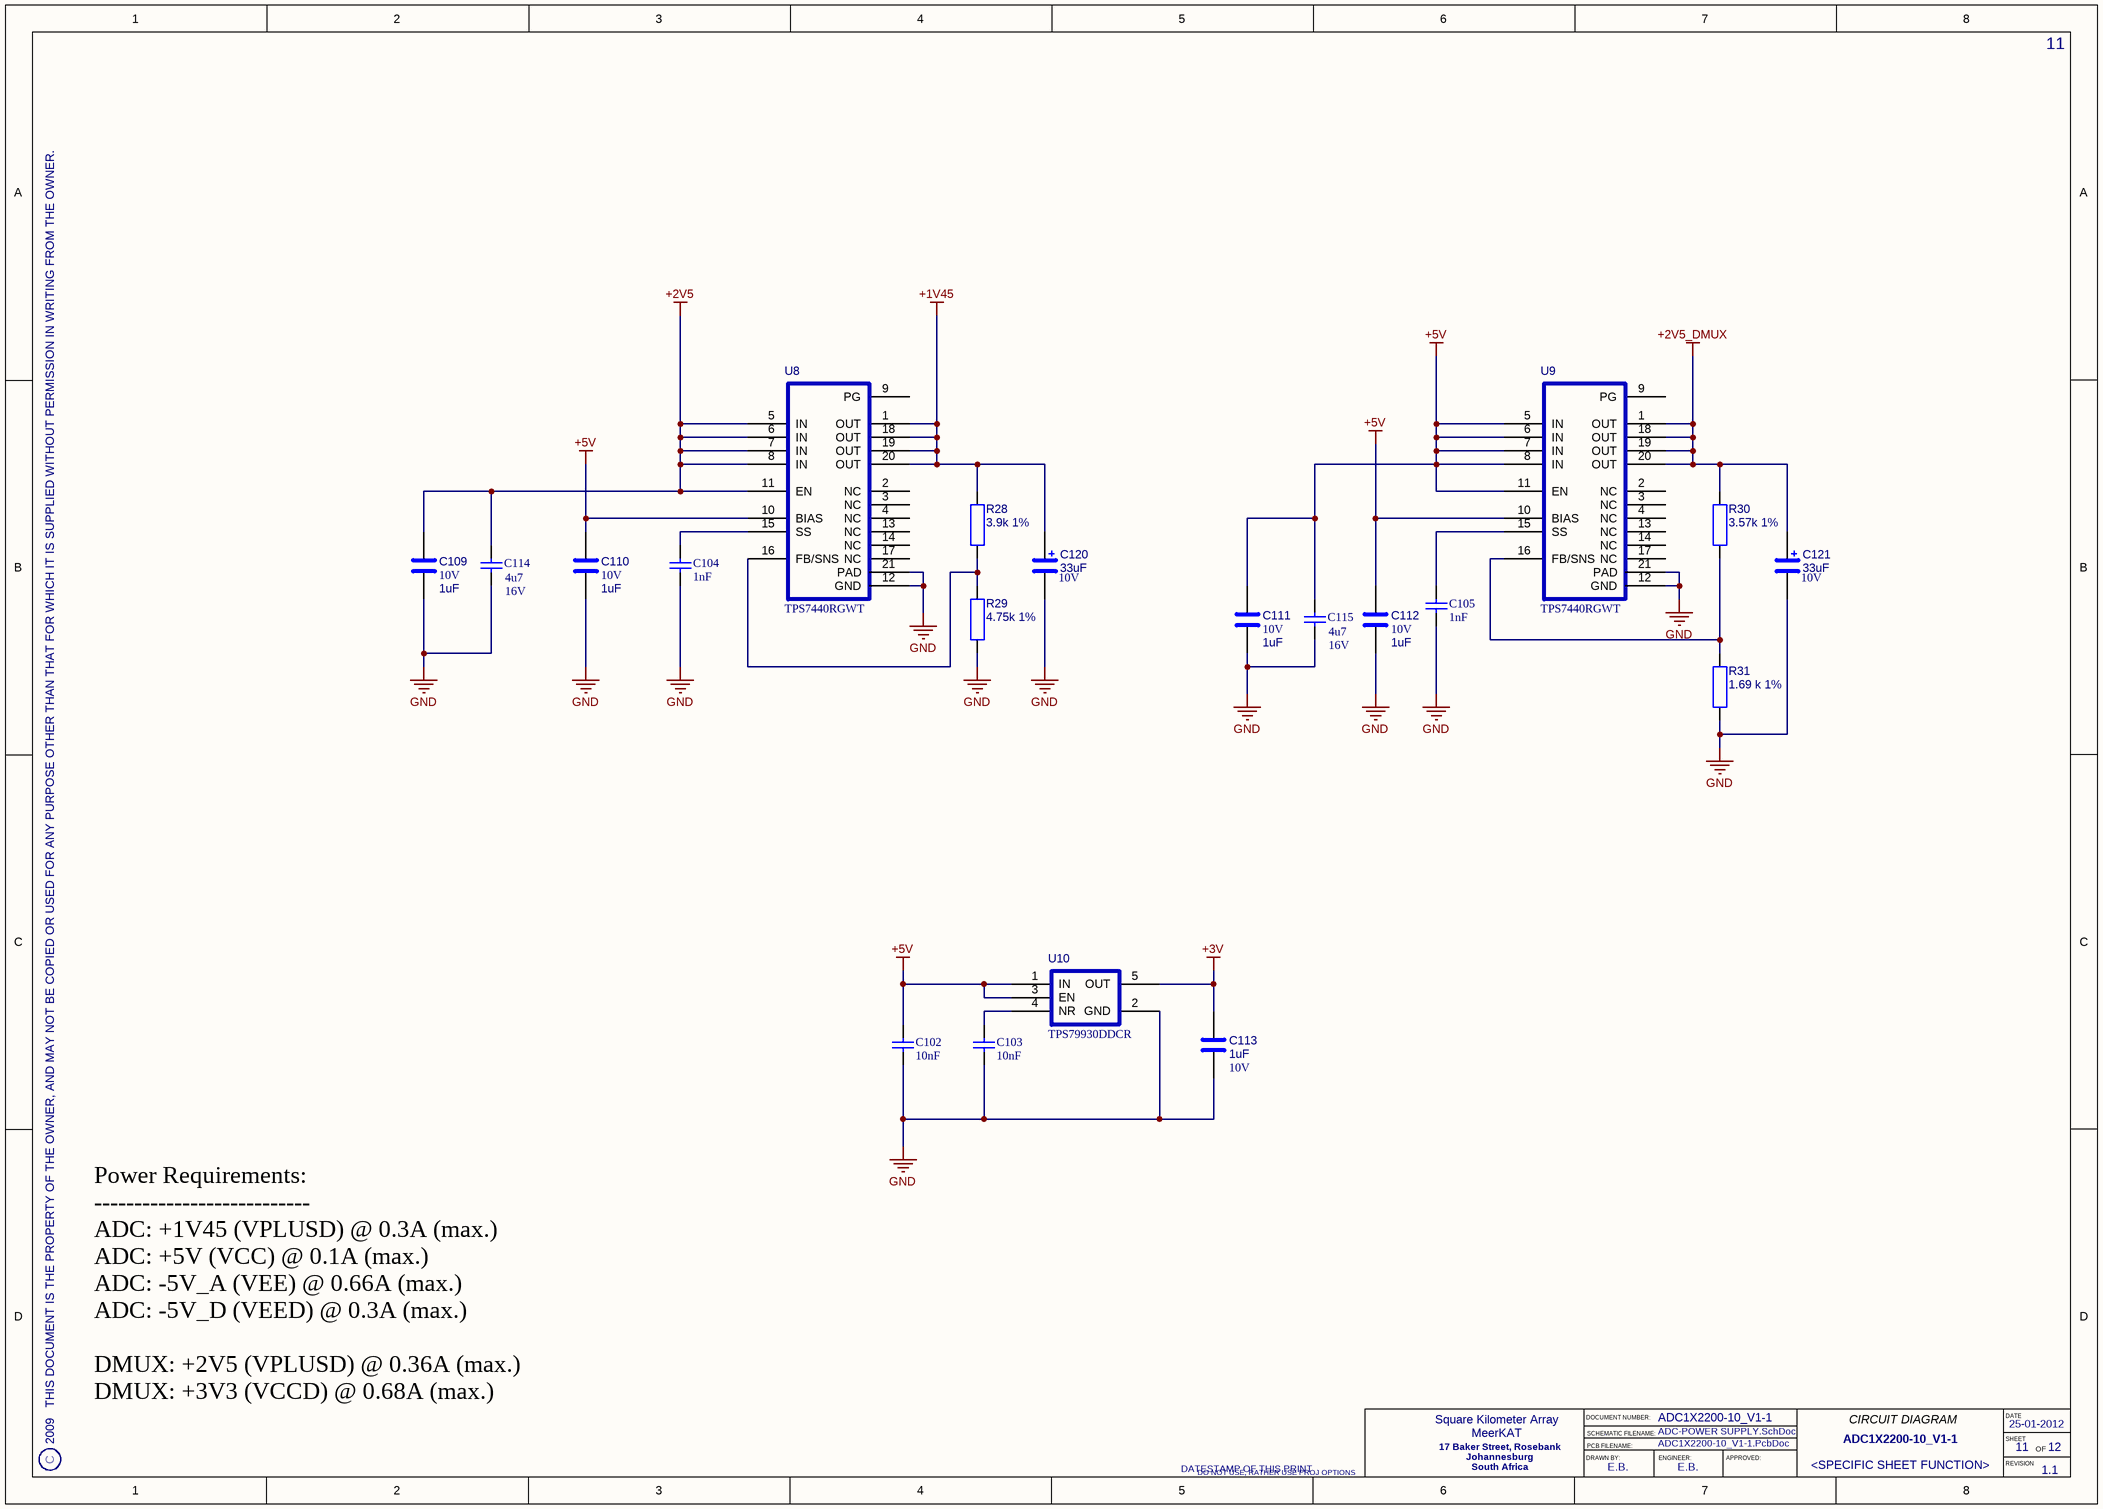
[diagram p11: ADC-POWER SUPPLY.SchDoc]

### Parts
C102  value 10nF  [CAPC1005X55N]  (hidden comment: Capacitor 0402 SMD)
C103  value 10nF  [CAPC1005X55N]  (hidden comment: Capacitor 0402 SMD)
C104  value 1nF  [CAPC1005X55N]  (hidden comment: Capacitor 0402 SMD)
C105  value 1nF  [CAPC1005X55N]  (hidden comment: Capacitor 0402 SMD)
C109  value 1uF  Voltage: 10V  [CAPC1632X80USR]  (hidden comment: CAP SMD 1206)
C110  value 1uF  Voltage: 10V  [CAPC1632X80USR]  (hidden comment: CAP SMD 1206)
C111  value 1uF  Voltage: 10V  [CAPC1632X80USR]  (hidden comment: CAP SMD 1206)
C112  value 1uF  Voltage: 10V  [CAPC1632X80USR]  (hidden comment: CAP SMD 1206)
C113  value 1uF  Voltage: 10V  [CAPC1632X80USR]  (hidden comment: CAP SMD 1206)
C114  value 4u7  Voltage: 16V  [CAPC3225X220N]  (hidden comment: Capacitor 1210 SMD)
C115  value 4u7  Voltage: 16V  [CAPC3225X220N]  (hidden comment: Capacitor 1210 SMD)
C120  Voltage: 10V  [3528]  (hidden comment: 33uF)
C121  Voltage: 10V  [3528]  (hidden comment: 33uF)
R28  3.9k 1%  [0603]
R29  4.75k 1%  [0603]
R30  3.57k 1%  [0603]
R31  1.69 k 1%  [0603]
U8  TPS7440RGWT  [QFN65P500X500X100-21AN]
U9  TPS7440RGWT  [QFN65P500X500X100-21AN]
U10  TPS79930DDCR  [SOT95P280X110-5USR2]

### Nets
+1V45: C120.1 R28.1 U8.1(OUT) U8.18(OUT) U8.19(OUT) U8.20(OUT)
+2V5: C109.1 C114.2 U8.5(IN) U8.6(IN) U8.7(IN) U8.8(IN) U8.11(EN)
+2V5_DMUX: C121.1 R30.1 U9.1(OUT) U9.18(OUT) U9.19(OUT) U9.20(OUT)
+3V: C113.1 U10.5(OUT)
+5V: C102.1 C110.1 C111.1 C112.1 C115.2 U8.10(BIAS) U9.5(IN) U9.6(IN) U9.7(IN) U9.8(IN) U9.10(BIAS) U9.11(EN) U10.1(IN) U10.3(EN)
GND: C102.2 C103.2 C104.1 C105.1 C109.2 C110.2 C111.2 C112.2 C113.2 C114.1 C115.1 C120.2 C121.2 R29.1 R31.1 U8.12(GND) U8.21(PAD) U9.12(GND) U9.21(PAD) U10.2(GND)
NetC103_1: C103.1 U10.4(NR)
NetC104_2: C104.2 U8.15(SS)
NetC105_2: C105.2 U9.15(SS)
NetR28_2: R28.2 R29.2 U8.16(FB/SNS)
NetR30_2: R30.2 R31.2 U9.16(FB/SNS)

Not connected (* = marked no-connect by the designer): U8 2(NC) 3(NC) 4(NC) 9(PG) 13(NC) 14(NC) 17(NC); U9 2(NC) 3(NC) 4(NC) 9(PG) 13(NC) 14(NC) 17(NC)

### Notes on the sheet
- Power Requirements:
  ---------------------------
  ADC: +1V45 (VPLUSD) @ 0.3A (max.)
  ADC: +5V (VCC) @ 0.1A (max.)
  ADC: -5V_A (VEE) @ 0.66A (max.)
  ADC: -5V_D (VEED) @ 0.3A (max.)
  DMUX: +2V5 (VPLUSD) @ 0.36A (max.)
  DMUX: +3V3 (VCCD) @ 0.68A (max.)
- 2009   THIS DOCUMENT IS THE PROPERTY OF THE OWNER, AND MAY NOT BE COPIED OR USED FOR ANY PURPOSE OTHER THAN THAT FOR WHICH IT IS SUPPLIED WITHOUT PERMISSION IN WRITING FROM THE OWNER.
- C
- DATESTAMP OF THIS PRINT
- DRAWN BY:
- DOCUMENT NUMBER:
- SCHEMATIC FILENAME:
- PCB FILENAME:
- ENGINEER:
- APPROVED:
- CIRCUIT DIAGRAM
- DATE
- SHEET
- REVISION
- OF

### Library data of the parts
C102-C105 = cap0402: Created_By: EDA-ASA; Checked_By: *; Checked_Date: *; HelpURL: *; Supplier1: *; Supplier2: *; Unit_Cost: *; MOQ: *; Leadtime: *; Inventory_Stock: *; Tolerance: *; Wattage: *; Package: 0402; ComponentLinked1Description: *; ComponentLinked1URL: *; ComponentLinked2Description: *; ComponentLinked2URL: *; ComponentLinked3Description: *; ComponentLinked3URL: *; ComponentLinked4Description: *; ComponentLinked4URL: *
C109-C113 = CAP-0603: Manufacturer: *; Manufacturer_PN: *; Created_By: *; Checked_By: *; Checked_Date: *; HelpURL: *; ComponentLink1Description: Footprint Detail; ComponentLink1URL: *; ComponentLink2Description: Application Note; ComponentLink2URL: *; ComponentLink3Description: Layout Guidelines; ComponentLink3URL: *; ComponentLink4Description: Technology Reference; ComponentLink4URL: *; Supplier1: *; Supplier2: *; Unit_Cost: *; MOQ: *; Leadtime: *; Inventory_Stock: *; Tolerance: *; Wattage: *; Package: 1206; ComponentLink5Description: Production Detail; ComponentLink5URL: *; Note: *; Stock Code: *
C114 C115 = cap1210: Created_By: EDA-ASA; Checked_By: *; Checked_Date: *; HelpURL: *; Supplier1: *; Supplier2: *; Unit_Cost: *; MOQ: *; Leadtime: *; Inventory_Stock: *; Tolerance: *; Wattage: *; Package: 1210; ComponentLinked1Description: *; ComponentLinked1URL: *; ComponentLinked2Description: *; ComponentLinked2URL: *; ComponentLinked3Description: *; ComponentLinked3URL: *; ComponentLinked4Description: *; ComponentLinked4URL: *
C120 C121 = CAPACITOR-POLARISED: Created_By: EDA-ASA; Checked_By: *; Checked_Date: *; HelpURL: *; ComponentLinked1Description: *; ComponentLinked1URL: *; ComponentLinked2Description: *; ComponentLinked2URL: *; ComponentLinked3Description: *; ComponentLinked3URL: *; ComponentLinked4Description: *; ComponentLinked4URL: *; Supplier1: *; Supplier2: *; Unit_Cost: *; MOQ: *; Leadtime: *; Inventory_Stock: *; Tolerance: *; Wattage: *; Value: 33uF
R28-R31 = RES-0805: RESISTOR SMD 0603; Checked_By: NN; Manufacturer: *; Manufacturer_PN: *; Created_By: *; Checked_Date: 5-08-2009; HelpURL: *; ComponentLink1Description: Footprint Detail; ComponentLink1URL: *; ComponentLink2Description: Application Note; ComponentLink2URL: *; ComponentLink3Description: Layout Guidelines; ComponentLink3URL: *; ComponentLink4Description: Technology Reference; ComponentLink4URL: *; Supplier1: *; Supplier2: *; Unit_Cost: *; MOQ: *; Leadtime: *; Inventory_Stock: *; Tolerance: *; Wattage: *; Voltage: *; Package: 0603; ComponentLink5Description: Production Detail; ComponentLink5URL: *; Note: *; Stock Code: *
  R28: Value: 3.9k 1%
  R29: Value: 4.75k 1%
  R30: Value: 3.57k 1%
  R31: Value: 1.69 k 1%
U8 U9 = TPS74401RGWT: 3.0A Ultra-LDO with Programmable Soft-Start; Manufacturer: TI; Created_By: IN; Manufacturer_PN: TPS7440RGWT; Checked_By: *; Checked_Date: *; HelpURL: X:\Datasheets\By Manufacturer\TI\tps74401.pdf; ComponentLink1Description: Footprint Detail; ComponentLink1URL: X:\Datasheets\By Manufacturer\TI\tps74401.pdf#page=12; ComponentLink2Description: Application Note; ComponentLink2URL: X:\Datasheets\By Manufacturer\TI\tps74401.pdf#page=13; ComponentLink3Description: Layout Guidelines; ComponentLink3URL: X:\Datasheets\By Manufacturer\TI\tps74401.pdf#page=14; ComponentLink4Description: Technology Reference; ComponentLink4URL: X:\Datasheets\By Manufacturer\TI\tps74401.pdf#page=15; Supplier1: *; Supplier2: *; Unit_Cost: *; MOQ: *; Leadtime: *; Inventory_Stock: *; Tolerance: *; Wattage: *; Voltage: *; Package: *; ComponentLink5Description: Production Detail; ComponentLink5URL: *; Note: *; Stock Code: *
U10 = TPS7994DDCR: Low Quiescent Current, Ultra-Low Noise Dropout Linear Regulator; Manufacturer: TI; Created_By: IN; Manufacturer_PN: TPS79930DDCR; Checked_By: *; Checked_Date: *; HelpURL: X:\Datacheets\By_Manufacture\TI\296-17776-2.pdf; ComponentLink1Description: Footprint Detail; ComponentLink1URL: *; ComponentLink2Description: Application Note; ComponentLink2URL: *; ComponentLink3Description: Layout Guidelines; ComponentLink3URL: *; ComponentLink4Description: Technology Reference; ComponentLink4URL: *; Supplier1: *; Supplier2: *; Unit_Cost: *; MOQ: *; Leadtime: *; Inventory_Stock: *; Tolerance: *; Wattage: *; Voltage: *; Package: *; ComponentLink5Description: Production Detail; ComponentLink5URL: *; Note: *; Stock Code: *

## Nets that join several sheets
+1V45: ADC-ADC (15 pins), ADC-ADC PSU (15 pins), ADC-POWER SUPPLY (6 pins)
+2V5: ADC-PERIPHERALS (6 pins), ADC-Z-DOK (FILT1.2), ADC-POWER SUPPLY (7 pins)
+2V5_DMUX: ADC-DMUX (39 pins), ADC-DMUX PSU (36 pins), ADC-POWER SUPPLY (6 pins)
+3V: ADC-SYNC INPUT (C97.2 U3.1), ADC-POWER SUPPLY (C113.1 U10.5)
+3V3: ADC-PERIPHERALS (R26.1 R27.1), ADC-DMUX (39 pins), ADC-Z-DOK (FILT2.2), ADC-DMUX PSU (38 pins)
+5V: ADC-PERIPHERALS (11 pins), ADC-Z-DOK (FILT3.2), ADC-ADC (12 pins), ADC-POWER SUPPLY 2 (6 pins), ADC-ADC PSU (12 pins), ADC-POWER SUPPLY (14 pins)
-5V_A: ADC-EXTERNAL CLOCK INPUT (R34.2), ADC-ADC (31 pins), ADC-POWER SUPPLY 2 (C125.2 U13.3), ADC-ADC PSU (28 pins)
-5V_D: ADC-ADC (8 pins), ADC-POWER SUPPLY 2 (C129.2 U14.3), ADC-ADC PSU (8 pins)
GND: ADC-EXTERNAL CLOCK INPUT (J3.2 R2.1 R16.1 R17.1), ADC-ANALOGUE INPUT (J2.2), ADC-PERIPHERALS (16 pins), ADC-DMUX (35 pins), ADC-Z-DOK (13 pins), ADC-ADC (54 pins), ADC-POWER SUPPLY 2 (18 pins), ADC-SYNC INPUT (C97.1 J4.2 R5.2 U3.2), ADC-DMUX PSU (74 pins), ADC-ADC PSU (63 pins), ADC-POWER SUPPLY (20 pins)
AOR_N: ADC-DMUX (U2.A6), ADC-Z-DOK (J1.D14)
AOR_P: ADC-DMUX (U2.B6), ADC-Z-DOK (J1.D13)
ASYNCRST_2V5: ADC-PERIPHERALS (U7.3), ADC-Z-DOK (J1.D1)
ASYNCRST_3V3: ADC-PERIPHERALS (R27.2 U7.4), ADC-DMUX (U2.B17)
BOR_N: ADC-DMUX (U2.H1), ADC-Z-DOK (J1.C4)
BOR_P: ADC-DMUX (U2.J2), ADC-Z-DOK (J1.C3)
CLK_N: ADC-EXTERNAL CLOCK INPUT (C95.2 R16.2 R34.1), ADC-ADC (U1.F1)
CLK_P: ADC-EXTERNAL CLOCK INPUT (C96.2 R17.2), ADC-ADC (U1.E1)
D0_N: ADC-DMUX (U2.D18), ADC-ADC (U1.D15)
D0_P: ADC-DMUX (U2.D19), ADC-ADC (U1.D16)
D1_N: ADC-DMUX (U2.E18), ADC-ADC (U1.E15)
D1_P: ADC-DMUX (U2.E19), ADC-ADC (U1.E16)
D2_N: ADC-DMUX (U2.F18), ADC-ADC (U1.F15)
D2_P: ADC-DMUX (U2.F19), ADC-ADC (U1.F16)
D3_N: ADC-DMUX (U2.G18), ADC-ADC (U1.G15)
D3_P: ADC-DMUX (U2.G19), ADC-ADC (U1.G16)
D4_N: ADC-DMUX (U2.J18), ADC-ADC (U1.J15)
D4_P: ADC-DMUX (U2.J19), ADC-ADC (U1.J16)
D5_N: ADC-DMUX (U2.K18), ADC-ADC (U1.K15)
D5_P: ADC-DMUX (U2.K19), ADC-ADC (U1.K16)
D6_N: ADC-DMUX (U2.L18), ADC-ADC (U1.L15)
D6_P: ADC-DMUX (U2.L19), ADC-ADC (U1.L16)
D7_N: ADC-DMUX (U2.M18), ADC-ADC (U1.M15)
D7_P: ADC-DMUX (U2.M19), ADC-ADC (U1.M16)
D8_N: ADC-DMUX (U2.N18), ADC-ADC (U1.N15)
D8_P: ADC-DMUX (U2.N19), ADC-ADC (U1.N16)
D9_N: ADC-DMUX (U2.P18), ADC-ADC (U1.P15)
D9_P: ADC-DMUX (U2.P19), ADC-ADC (U1.P16)
DA0_N: ADC-DMUX (U2.A16), ADC-Z-DOK (J1.F20)
DA0_P: ADC-DMUX (U2.B16), ADC-Z-DOK (J1.F19)
DA1_N: ADC-DMUX (U2.A15), ADC-Z-DOK (J1.D20)
DA1_P: ADC-DMUX (U2.B15), ADC-Z-DOK (J1.D19)
DA2_N: ADC-DMUX (U2.A14), ADC-Z-DOK (J1.F18)
DA2_P: ADC-DMUX (U2.B14), ADC-Z-DOK (J1.F17)
DA3_N: ADC-DMUX (U2.A13), ADC-Z-DOK (J1.D18)
DA3_P: ADC-DMUX (U2.B13), ADC-Z-DOK (J1.D17)
DA4_N: ADC-DMUX (U2.A12), ADC-Z-DOK (J1.C18)
DA4_P: ADC-DMUX (U2.B12), ADC-Z-DOK (J1.C17)
DA5_N: ADC-DMUX (U2.A11), ADC-Z-DOK (J1.F16)
DA5_P: ADC-DMUX (U2.B11), ADC-Z-DOK (J1.F15)
DA6_N: ADC-DMUX (U2.A10), ADC-Z-DOK (J1.D16)
DA6_P: ADC-DMUX (U2.B10), ADC-Z-DOK (J1.D15)
DA7_N: ADC-DMUX (U2.A9), ADC-Z-DOK (J1.C16)
DA7_P: ADC-DMUX (U2.B9), ADC-Z-DOK (J1.C15)
DA8_N: ADC-DMUX (U2.A8), ADC-Z-DOK (J1.F14)
DA8_P: ADC-DMUX (U2.B8), ADC-Z-DOK (J1.F13)
DA9_N: ADC-DMUX (U2.A7), ADC-Z-DOK (J1.C14)
DA9_P: ADC-DMUX (U2.B7), ADC-Z-DOK (J1.C13)
DB0_N: ADC-DMUX (U2.A5), ADC-Z-DOK (J1.F12)
DB0_P: ADC-DMUX (U2.B5), ADC-Z-DOK (J1.F11)
DB1_N: ADC-DMUX (U2.A4), ADC-Z-DOK (J1.C12)
DB1_P: ADC-DMUX (U2.B4), ADC-Z-DOK (J1.C11)
DB2_N: ADC-DMUX (U2.A3), ADC-Z-DOK (J1.F10)
DB2_P: ADC-DMUX (U2.B3), ADC-Z-DOK (J1.F9)
DB3_N: ADC-DMUX (U2.A2), ADC-Z-DOK (J1.C10)
DB3_P: ADC-DMUX (U2.B2), ADC-Z-DOK (J1.C9)
DB4_N: ADC-DMUX (U2.B1), ADC-Z-DOK (J1.A10)
DB4_P: ADC-DMUX (U2.C2), ADC-Z-DOK (J1.A9)
DB5_N: ADC-DMUX (U2.C1), ADC-Z-DOK (J1.C8)
DB5_P: ADC-DMUX (U2.D2), ADC-Z-DOK (J1.C7)
DB6_N: ADC-DMUX (U2.D1), ADC-Z-DOK (J1.A8)
DB6_P: ADC-DMUX (U2.E2), ADC-Z-DOK (J1.A7)
DB7_N: ADC-DMUX (U2.E1), ADC-Z-DOK (J1.D8)
DB7_P: ADC-DMUX (U2.F2), ADC-Z-DOK (J1.D7)
DB8_N: ADC-DMUX (U2.F1), ADC-Z-DOK (J1.C6)
DB8_P: ADC-DMUX (U2.G2), ADC-Z-DOK (J1.C5)
DB9_N: ADC-DMUX (U2.G1), ADC-Z-DOK (J1.A6)
DB9_P: ADC-DMUX (U2.H2), ADC-Z-DOK (J1.A5)
DCLK_N: ADC-DMUX (U2.K2), ADC-Z-DOK (J1.C20)
DCLK_P: ADC-DMUX (U2.J1), ADC-Z-DOK (J1.C19)
DMUX_BIST_2V5: ADC-PERIPHERALS (U7.1), ADC-Z-DOK (J1.F1)
DMUX_BIST_3V3: ADC-PERIPHERALS (R26.2 U7.6), ADC-DMUX (U2.V17)
DR_N: ADC-DMUX (U2.H18), ADC-ADC (U1.H15)
DR_P: ADC-DMUX (U2.H19), ADC-ADC (U1.H16)
I2C_SCL: ADC-PERIPHERALS (J5.1 R13.2 U4.3), ADC-Z-DOK (J1.F2)
I2C_SDA: ADC-PERIPHERALS (J5.3 R12.2 U4.4), ADC-Z-DOK (J1.D2)
OR_N: ADC-DMUX (U2.B18), ADC-ADC (U1.C15)
OR_P: ADC-DMUX (U2.B19), ADC-ADC (U1.C16)
SYNC_N: ADC-Z-DOK (J1.F4), ADC-SYNC INPUT (U3.3)
SYNC_P: ADC-Z-DOK (J1.F3), ADC-SYNC INPUT (U3.4)
TDIODE: ADC-PERIPHERALS (C106.2 R3.1), ADC-ADC (R11.1)
VIN: ADC-ANALOGUE INPUT (C108.2), ADC-ADC (U1.R5)